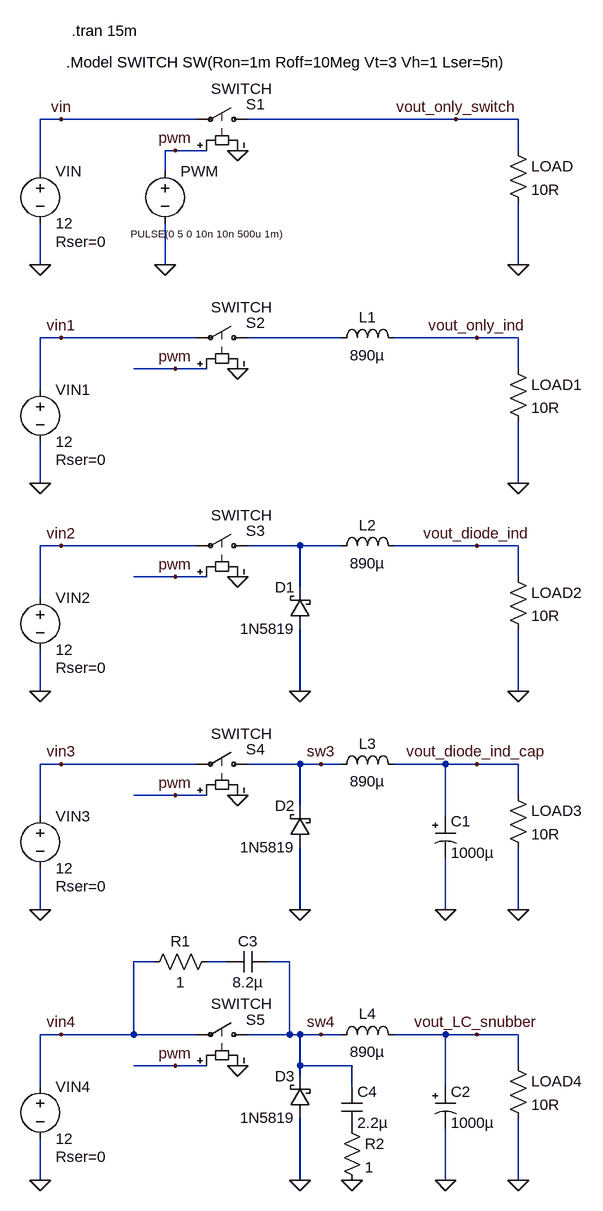
[diagram p0: schematic 01-buck_converter_basic.asc]
01-buck_converter_basic.asc, the LTspice schematic file:
Version 4
SHEET 1 880 1700
WIRE -128 48 -160 48
WIRE 80 48 -128 48
WIRE 480 48 160 48
WIRE 576 48 480 48
WIRE 48 96 32 96
WIRE 96 96 48 96
WIRE 576 96 576 48
WIRE -160 128 -160 48
WIRE 32 128 32 96
WIRE -160 272 -160 208
WIRE 32 272 32 208
WIRE 576 272 576 176
WIRE -128 384 -160 384
WIRE 80 384 -128 384
WIRE 304 384 160 384
WIRE 512 384 384 384
WIRE 576 384 512 384
WIRE 48 432 -16 432
WIRE 96 432 48 432
WIRE 576 432 576 384
WIRE -160 464 -160 384
WIRE -160 608 -160 544
WIRE 576 608 576 512
WIRE -128 704 -160 704
WIRE 80 704 -128 704
WIRE 240 704 160 704
WIRE 304 704 240 704
WIRE 512 704 384 704
WIRE 576 704 512 704
WIRE 48 752 -16 752
WIRE 96 752 48 752
WIRE 576 752 576 704
WIRE 240 768 240 704
WIRE -160 784 -160 704
WIRE -160 928 -160 864
WIRE 240 928 240 832
WIRE 576 928 576 832
WIRE -128 1040 -160 1040
WIRE 80 1040 -128 1040
WIRE 240 1040 160 1040
WIRE 272 1040 240 1040
WIRE 304 1040 272 1040
WIRE 464 1040 384 1040
WIRE 512 1040 464 1040
WIRE 576 1040 512 1040
WIRE 48 1088 -16 1088
WIRE 96 1088 48 1088
WIRE 576 1088 576 1040
WIRE 240 1104 240 1040
WIRE -160 1120 -160 1040
WIRE 464 1120 464 1040
WIRE -160 1264 -160 1200
WIRE 240 1264 240 1168
WIRE 464 1264 464 1184
WIRE 576 1264 576 1168
WIRE 16 1344 -16 1344
WIRE 128 1344 96 1344
WIRE 224 1344 192 1344
WIRE -128 1456 -160 1456
WIRE -16 1456 -16 1344
WIRE -16 1456 -128 1456
WIRE 80 1456 -16 1456
WIRE 224 1456 224 1344
WIRE 224 1456 160 1456
WIRE 240 1456 224 1456
WIRE 272 1456 240 1456
WIRE 304 1456 272 1456
WIRE 464 1456 384 1456
WIRE 512 1456 464 1456
WIRE 576 1456 512 1456
WIRE 48 1504 -16 1504
WIRE 96 1504 48 1504
WIRE 240 1504 240 1456
WIRE 320 1504 240 1504
WIRE 576 1504 576 1456
WIRE 240 1520 240 1504
WIRE -160 1536 -160 1456
WIRE 320 1536 320 1504
WIRE 464 1536 464 1456
WIRE -160 1680 -160 1616
WIRE 240 1680 240 1584
WIRE 464 1680 464 1600
WIRE 576 1680 576 1584
FLAG 144 96 0
FLAG -160 272 0
FLAG 32 272 0
FLAG 48 96 pwm
FLAG 576 272 0
FLAG -128 48 vin
FLAG 480 48 vout_only_switch
FLAG 144 432 0
FLAG 48 432 pwm
FLAG 576 608 0
FLAG 512 384 vout_only_ind
FLAG -160 608 0
FLAG -128 384 vin1
FLAG 144 752 0
FLAG 48 752 pwm
FLAG 576 928 0
FLAG 512 704 vout_diode_ind
FLAG -160 928 0
FLAG -128 704 vin2
FLAG 240 928 0
FLAG 144 1088 0
FLAG 48 1088 pwm
FLAG 576 1264 0
FLAG 512 1040 vout_diode_ind_cap
FLAG -160 1264 0
FLAG -128 1040 vin3
FLAG 240 1264 0
FLAG 464 1264 0
FLAG 144 1504 0
FLAG 48 1504 pwm
FLAG 576 1680 0
FLAG 512 1456 vout_LC_snubber
FLAG -160 1680 0
FLAG -128 1456 vin4
FLAG 240 1680 0
FLAG 464 1680 0
FLAG 320 1680 0
FLAG 272 1040 sw3
FLAG 272 1456 sw4
SYMBOL voltage -160 112 R0
WINDOW 123 0 0 Left 0
WINDOW 39 24 124 Left 2
SYMATTR InstName VIN
SYMATTR Value 12
SYMATTR SpiceLine Rser=0
SYMBOL sw 176 48 M270
WINDOW 0 23 19 VLeft 2
WINDOW 3 47 73 VLeft 2
SYMATTR InstName S1
SYMATTR Value SWITCH
SYMBOL voltage 32 112 R0
WINDOW 3 -53 112 Left 1
WINDOW 123 0 0 Left 0
WINDOW 39 0 0 Left 0
SYMATTR InstName PWM
SYMATTR Value PULSE(0 5 0 10n 10n 500u 1m)
SYMBOL res 560 80 R0
SYMATTR InstName LOAD
SYMATTR Value 10R
SYMBOL sw 176 384 M270
WINDOW 0 23 19 VLeft 2
WINDOW 3 47 73 VLeft 2
SYMATTR InstName S2
SYMATTR Value SWITCH
SYMBOL res 560 416 R0
SYMATTR InstName LOAD1
SYMATTR Value 10R
SYMBOL voltage -160 448 R0
WINDOW 123 0 0 Left 0
WINDOW 39 24 124 Left 2
SYMATTR InstName VIN1
SYMATTR Value 12
SYMATTR SpiceLine Rser=0
SYMBOL ind 288 400 R270
WINDOW 0 32 56 VTop 2
WINDOW 3 5 56 VBottom 2
SYMATTR InstName L1
SYMATTR Value 890µ
SYMATTR SpiceLine Ipk=1 Rser=0.4 Cpar=37.891p
SYMBOL sw 176 704 M270
WINDOW 0 23 19 VLeft 2
WINDOW 3 47 73 VLeft 2
SYMATTR InstName S3
SYMATTR Value SWITCH
SYMBOL res 560 736 R0
SYMATTR InstName LOAD2
SYMATTR Value 10R
SYMBOL voltage -160 768 R0
WINDOW 123 0 0 Left 0
WINDOW 39 24 124 Left 2
SYMATTR InstName VIN2
SYMATTR Value 12
SYMATTR SpiceLine Rser=0
SYMBOL ind 288 720 R270
WINDOW 0 32 56 VTop 2
WINDOW 3 5 56 VBottom 2
SYMATTR InstName L2
SYMATTR Value 890µ
SYMATTR SpiceLine Ipk=1 Rser=0.4 Cpar=37.891p
SYMBOL schottky 256 832 R180
WINDOW 0 24 64 Left 2
WINDOW 3 24 0 Left 2
SYMATTR InstName D1
SYMATTR Value 1N5819
SYMATTR Description Diode
SYMATTR Type diode
SYMBOL sw 176 1040 M270
WINDOW 0 23 19 VLeft 2
WINDOW 3 47 73 VLeft 2
SYMATTR InstName S4
SYMATTR Value SWITCH
SYMBOL res 560 1072 R0
SYMATTR InstName LOAD3
SYMATTR Value 10R
SYMBOL voltage -160 1104 R0
WINDOW 123 0 0 Left 0
WINDOW 39 24 124 Left 2
SYMATTR InstName VIN3
SYMATTR Value 12
SYMATTR SpiceLine Rser=0
SYMBOL ind 288 1056 R270
WINDOW 0 32 56 VTop 2
WINDOW 3 5 56 VBottom 2
SYMATTR InstName L3
SYMATTR Value 890µ
SYMATTR SpiceLine Ipk=1 Rser=0.4 Cpar=37.891p
SYMBOL schottky 256 1168 R180
WINDOW 0 24 64 Left 2
WINDOW 3 24 0 Left 2
SYMATTR InstName D2
SYMATTR Value 1N5819
SYMATTR Description Diode
SYMATTR Type diode
SYMBOL polcap 448 1120 R0
WINDOW 3 24 56 Left 2
SYMATTR InstName C1
SYMATTR Value 1000µ
SYMATTR Description Capacitor
SYMATTR Type cap
SYMATTR SpiceLine V=16 Irms=700m Rser=0.12 Lser=0 mfg="Nichicon" pn="UPR1C102MPH" type="Al electrolytic"
SYMBOL sw 176 1456 M270
WINDOW 0 23 19 VLeft 2
WINDOW 3 47 73 VLeft 2
SYMATTR InstName S5
SYMATTR Value SWITCH
SYMBOL res 560 1488 R0
SYMATTR InstName LOAD4
SYMATTR Value 10R
SYMBOL voltage -160 1520 R0
WINDOW 123 0 0 Left 0
WINDOW 39 24 124 Left 2
SYMATTR InstName VIN4
SYMATTR Value 12
SYMATTR SpiceLine Rser=0
SYMBOL ind 288 1472 R270
WINDOW 0 32 56 VTop 2
WINDOW 3 5 56 VBottom 2
SYMATTR InstName L4
SYMATTR Value 890µ
SYMATTR SpiceLine Ipk=1 Rser=0.4 Cpar=37.891p
SYMBOL schottky 256 1584 R180
WINDOW 0 24 64 Left 2
WINDOW 3 24 0 Left 2
SYMATTR InstName D3
SYMATTR Value 1N5819
SYMATTR Description Diode
SYMATTR Type diode
SYMBOL polcap 448 1536 R0
WINDOW 3 24 56 Left 2
SYMATTR InstName C2
SYMATTR Value 1000µ
SYMATTR Description Capacitor
SYMATTR Type cap
SYMATTR SpiceLine V=16 Irms=700m Rser=0.001 Lser=0
SYMBOL res 112 1328 R90
WINDOW 0 0 56 VBottom 2
WINDOW 3 32 56 VTop 2
SYMATTR InstName R1
SYMATTR Value 1
SYMBOL cap 192 1328 R90
WINDOW 0 0 32 VBottom 2
WINDOW 3 32 32 VTop 2
SYMATTR InstName C3
SYMATTR Value 8.2µ
SYMBOL res 304 1584 R0
SYMATTR InstName R2
SYMATTR Value 1
SYMBOL cap 304 1536 R0
SYMATTR InstName C4
SYMATTR Value 2.2µ
TEXT -120 -40 Left 2 !.Model SWITCH SW(Ron=1m Roff=10Meg Vt=3 Vh=1 Lser=5n)
TEXT -112 -88 Left 2 !.tran 15m

The netlist it stands for:
* 01-buck_converter_basic.asc
VIN vin 0 12 Rser=0
S1 vout_only_switch vin pwm 0 SWITCH
V§PWM pwm 0 PULSE(0 5 0 10n 10n 500u 1m)
R§LOAD vout_only_switch 0 10R
S2 N001 vin1 pwm 0 SWITCH
R§LOAD1 vout_only_ind 0 10R
VIN1 vin1 0 12 Rser=0
L1 N001 vout_only_ind 890µ Ipk=1 Rser=0.4 Cpar=37.891p
S3 N002 vin2 pwm 0 SWITCH
R§LOAD2 vout_diode_ind 0 10R
VIN2 vin2 0 12 Rser=0
L2 N002 vout_diode_ind 890µ Ipk=1 Rser=0.4 Cpar=37.891p
D1 0 N002 1N5819
S4 sw3 vin3 pwm 0 SWITCH
R§LOAD3 vout_diode_ind_cap 0 10R
VIN3 vin3 0 12 Rser=0
L3 sw3 vout_diode_ind_cap 890µ Ipk=1 Rser=0.4 Cpar=37.891p
D2 0 sw3 1N5819
C1 vout_diode_ind_cap 0 1000µ V=16 Irms=700m Rser=0.12 Lser=0 mfg="Nichicon" pn="UPR1C102MPH" type="Al electrolytic"
S5 sw4 vin4 pwm 0 SWITCH
R§LOAD4 vout_LC_snubber 0 10R
VIN4 vin4 0 12 Rser=0
L4 sw4 vout_LC_snubber 890µ Ipk=1 Rser=0.4 Cpar=37.891p
D3 0 sw4 1N5819
C2 vout_LC_snubber 0 1000µ V=16 Irms=700m Rser=0.001 Lser=0
R1 N003 vin4 1
C3 sw4 N003 8.2µ
R2 P001 0 1
C4 sw4 P001 2.2µ
.model D D
.lib standard.dio
.Model SWITCH SW(Ron=1m Roff=10Meg Vt=3 Vh=1 Lser=5n)
.tran 15m
.backanno
.end